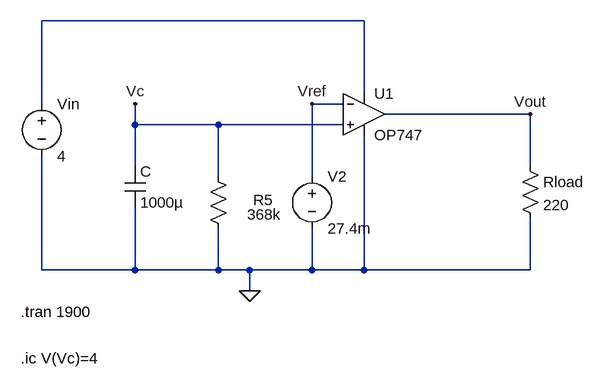
[diagram p0: schematic water_timer.asc]
water_timer.asc, the LTspice schematic file:
Version 4
SHEET 1 5888 1544
WIRE 192 -64 -304 -64
WIRE 192 48 192 -64
WIRE -304 64 -304 -64
WIRE 160 64 112 64
WIRE 448 80 224 80
WIRE -160 96 -160 64
WIRE -32 96 -160 96
WIRE 160 96 -32 96
WIRE -160 160 -160 96
WIRE 448 160 448 80
WIRE -32 176 -32 96
WIRE 112 176 112 64
WIRE -304 320 -304 144
WIRE -160 320 -160 224
WIRE -160 320 -304 320
WIRE -32 320 -32 256
WIRE -32 320 -160 320
WIRE 16 320 -32 320
WIRE 112 320 112 256
WIRE 112 320 16 320
WIRE 192 320 192 112
WIRE 192 320 112 320
WIRE 448 320 448 240
WIRE 448 320 192 320
WIRE 16 352 16 320
FLAG 16 352 0
FLAG -160 64 Vc
FLAG 448 80 Vout
FLAG 112 64 Vref
SYMBOL cap -176 160 R0
WINDOW 39 24 86 Left 2
SYMATTR InstName C
SYMATTR Value 1000µ
SYMBOL voltage -304 48 R0
SYMATTR InstName Vin
SYMATTR Value 4
SYMBOL res 432 144 R0
SYMATTR InstName Rload
SYMATTR Value 220
SYMBOL OpAmps\\OP747 192 16 R0
SYMATTR InstName U1
SYMBOL res -16 272 R180
WINDOW 0 -68 60 Left 2
WINDOW 3 -81 38 Left 2
SYMATTR InstName R5
SYMATTR Value 368k
SYMBOL voltage 112 160 R0
SYMATTR InstName V2
SYMATTR Value 27.4m
TEXT -336 384 Left 2 !.tran 1900
TEXT -336 456 Left 2 !.ic V(Vc)=4

The netlist it stands for:
* water_timer.asc
C Vc 0 1000µ
Vin N001 0 4
Rload Vout 0 220
XU1 Vc Vref N001 0 Vout OP747  ; pins In+ In- V+ V- OUT
R5 0 Vc 368k
V2 Vref 0 27.4m
.tran 1900
.ic V(Vc)=4
.backanno
.end